# EasyEDA schematic SCH_12V_5A_PSU_2023-10-23.json
TITLE: FINAL PSU 12V 5A (WITH LINEAR VOLTAGE RAGULATOR; REV: 1.0; Date: 2023-10-07; Sheet: 1/1; Drawn By: OBIDULLAH MAHMUD JAMY; Company: CUET
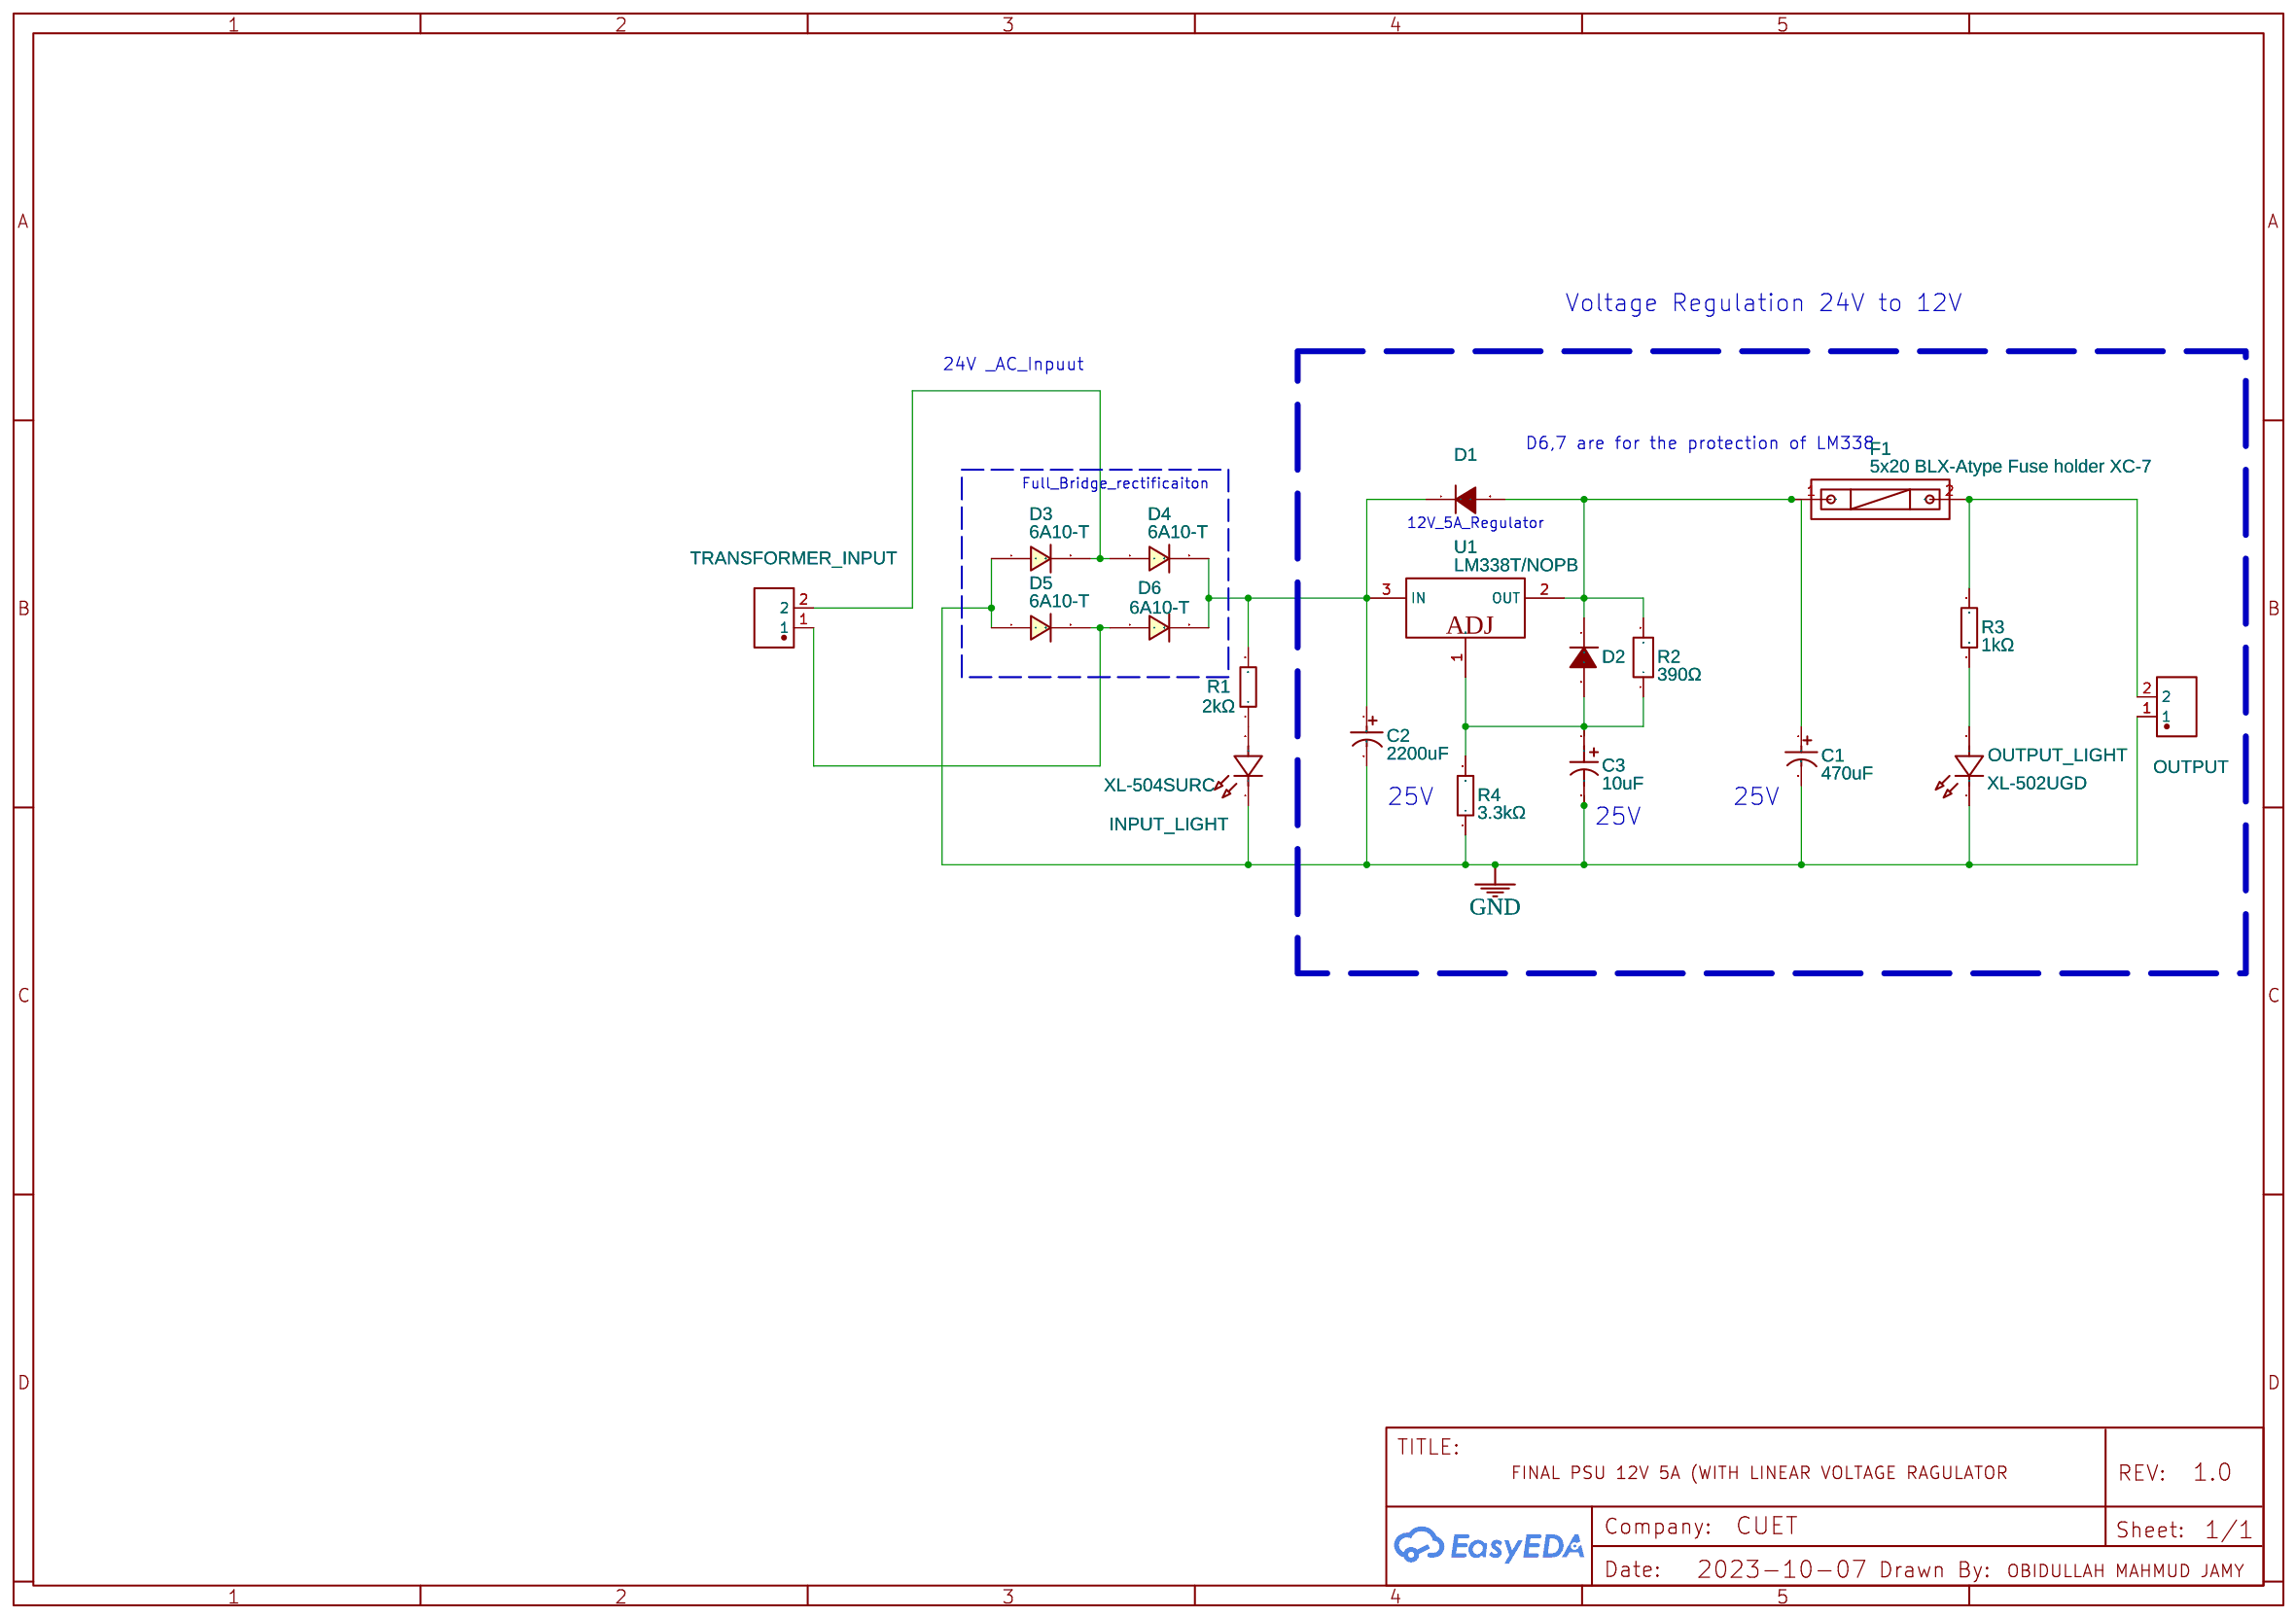
[diagram p0: schematic sheet]

## Parts
C1  470uF  [CAP-TH_BD8.0-P3.50-D0.6-FD]
C2  2200uF  [CAP-TH_BD12.5-P5.00-D0.6-FD]
C3  10uF  [CAP-TH_BD8.0-P3.50-D1.0-FD]
D1  1N4007  [DO-41_BD2.4-L4.7-P8.70-D0.9-RD]
D2  1N4007  [DO-41_BD2.4-L4.7-P8.70-D0.9-RD]
D3  6A10-T  [R-6_BD9.0-L9.0-W9.0-P15.00-D1.7-FD]
D4  6A10-T  [R-6_BD9.0-L9.0-W9.0-P15.00-D1.7-FD]
D5  6A10-T  [R-6_BD9.0-L9.0-W9.0-P15.00-D1.7-FD]
D6  6A10-T  [R-6_BD9.0-L9.0-W9.0-P15.00-D1.7-FD]
F1  5x20 BLX-Atype Fuse holder XC-7  [FUSE-TH_L22.6-W9.0]
INPUT_LIGHT  XL-504SURC  [LED-TH_BD5.9-P2.54-RD_RED]
OUTPUT  KF129-7.5-2P  [CONN-TH_P7.50_KF129-7.5-2P]
OUTPUT_LIGHT  XL-502UGD  [LED-TH_BD5.9-P2.54-RD_GREEN]
R1  2kΩ  [RES-TH_BD2.3-L6.5-P10.50-D0.5]
R2  390Ω  [RES-TH_BD2.7-L6.2-P10.20-D0.4]
R3  1kΩ  [RES-TH_BD5.5-L15.0-P19.00-D0.8]
R4  3.3kΩ  [RES-TH_BD2.3-L6.5-P10.50-D0.5]
TRANSFORMER_INPUT  KF129-7.5-2P  [CONN-TH_P7.50_KF129-7.5-2P]
U1  LM338T/NOPB  [TO-220-3_L10.0-W4.5-P2.54-L]

## Library data of the parts
C1 = 470uF 25V 8*12Black high frequency: Supplier: LCSC; Manufacturer: CX(承兴); Manufacturer Part: GR477M025F12RR0VH4FP0; Supplier Part: C44602; JLCPCB Part Class: Extended Part; link: https://lcsc.com/eda_search?q=C44602&%26type=1&ref=editor
C2 = 2200uF 25V 13*25VPurple high frequency: Supplier: LCSC; Manufacturer: CX(承兴); Manufacturer Part: GR228M025J25RR0VZ2FP0; Supplier Part: C45066; JLCPCB Part Class: Extended Part; link: https://lcsc.com/eda_search?q=C45066&%26type=1&ref=editor
C3 = EG22GM100F13CTBVZC-L=3.5: Contributor: LCSC; Supplier: LCSC; Supplier Part: C2940268; Manufacturer: Yunxing(云星); link: https://lcsc.com/eda_search?q=C2940268&%26type=1&ref=editor
D1 D2 = 1N4007: Supplier: LCSC; Manufacturer: ST(先科); Supplier Part: C106903; JLCPCB Part Class: Extended Part; link: https://lcsc.com/eda_search?q=C106903&%26type=1&ref=editor
D3-D6 = 6A10-T: Contributor: LCSC; Supplier: LCSC; Supplier Part: C435856; Manufacturer: DIODES(美台); JLCPCB Part Class: Extended Part; link: https://lcsc.com/eda_search?q=C435856&%26type=1&ref=editor
F1 = 5x20 BLX-Atype Fuse holder XC-7: Supplier: LCSC; Manufacturer Part: 5x20 BLX-A型 保险丝支架 XC-7; Manufacturer: xcfuse(旭程); Supplier Part: C3131; JLCPCB Part Class: Extended Part; link: https://lcsc.com/eda_search?q=C3131&%26type=1&ref=editor
INPUT_LIGHT = XL-504SURC: Contributor: lcsc; Supplier: LCSC; Manufacturer: XINGLIGHT(成兴光); JLCPCB Part Class: Extended Part
OUTPUT TRANSFORMER_INPUT = KF129-7.5-2P: Supplier: LCSC; Supplier Part: C475094; Manufacturer: KEFA(科发); Contributor: LCSC; JLCPCB Part Class: Extended Part
OUTPUT_LIGHT = XL-502UGD: Contributor: lcsc; Supplier: LCSC; Supplier Part: C2895548; Manufacturer: XINGLIGHT(成兴光); JLCPCB Part Class: Extended Part; link: https://lcsc.com/eda_search?q=C2895548&%26type=1&ref=editor
R1 = CF1/4W-2KΩ±5% T52: Contributor: LCSC; Supplier: LCSC; Supplier Part: C120062; Manufacturer: CCO(千志电子); Manufacturer Part: CF1/4W-2KΩ±5% T; JLCPCB Part Class: Extended Part; link: https://lcsc.com/eda_search?q=C120062&%26type=1&ref=editor
R2 = CR1/4W-390Ω±5%-ST26: Contributor: lcsc; Supplier: LCSC; Supplier Part: C2894634; Manufacturer: VO(翔胜); link: https://lcsc.com/eda_search?q=C2894634&%26type=1&ref=editor
R3 = MFR3WSJT-73-1K: Contributor: LCSC; Supplier: LCSC; Supplier Part: C176599; Manufacturer: YAGEO(国巨); JLCPCB Part Class: Extended Part; link: https://lcsc.com/eda_search?q=C176599&%26type=1&ref=editor
R4 = CF1/4W-3.3KΩ±5%T52: Contributor: lcsc; Supplier: LCSC; Supplier Part: C714309; Manufacturer: 华星机电; JLCPCB Part Class: Extended Part; link: https://lcsc.com/eda_search?q=C714309&%26type=1&ref=editor
U1 = LM338T/NOPB: Supplier: LCSC; Manufacturer: TI(德州仪器); Supplier Part: C53303; JLCPCB Part Class: Extended Part; link: https://lcsc.com/eda_search?q=C53303&%26type=1&ref=editor

## Nets
GND: C1.2 C2.2 C3.2 D3.1(A) D5.1(A) INPUT_LIGHT.1(K) OUTPUT.1 OUTPUT_LIGHT.1(K) R4.1
Net-(C1-1): C1.1 D1.2(A) D2.1(K) F1.1 R2.2 U1.2(OUT)
Net-(C2-1): C2.1 D1.1(K) D4.2(C) D6.2(C) R1.2 U1.3(IN)
Net-(C3-1): C3.1 D2.2(A) R2.1 R4.2 U1.1(ADJ)
Net-(D3-2): D3.2(C) D4.1(A) TRANSFORMER_INPUT.2
Net-(D5-2): D5.2(C) D6.1(A) TRANSFORMER_INPUT.1
Net-(F1-2): F1.2 OUTPUT.2 R3.2
Net-(INPUT_LIGHT-2): INPUT_LIGHT.2(A) R1.1
Net-(OUTPUT_LIGHT-2): OUTPUT_LIGHT.2(A) R3.1

## Notes on the sheet
- Voltage Regulation 24V to 12V
- 24V _AC_Inpuut
- D6,7 are for the protection of LM338
- Full_Bridge_rectificaiton
- 12V_5A_Regulator
- 25V
- 25V
- 25V
